# Altium project Orient2.PrjPcb (part 2 of 6)

## Sheet P02_MPU1_JTAG.SchDoc
size A
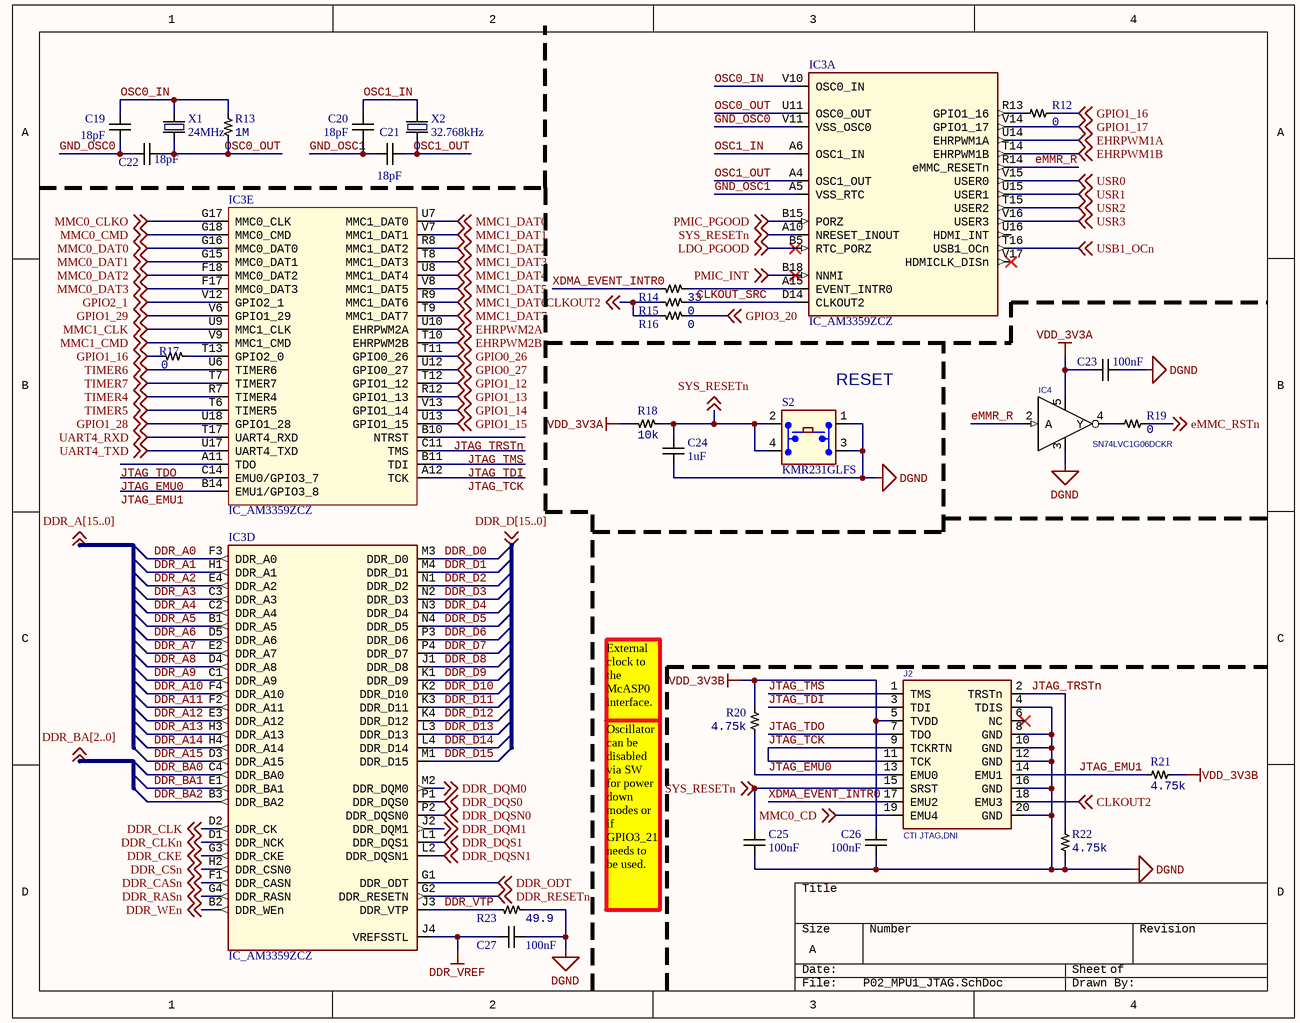
[diagram p1: P02_MPU1_JTAG.SchDoc]

### Parts
C19  Capacitance: 18pF  [CAP0402]  (hidden comment: CC0402JRNPO9BN180)
C20  Capacitance: 18pF  [CAP0402]  (hidden comment: CC0402JRNPO9BN180)
C21  Capacitance: 18pF  [CAP0402]  (hidden comment: CC0402JRNPO9BN180)
C22  Capacitance: 18pF  [CAP0402]  (hidden comment: CC0402JRNPO9BN180)
C23  Capacitance: 100nF  [CAP0402]  (hidden comment: C0402C104K4RACTU)
C24  Capacitance: 1uF  [CAP0402]  (hidden comment: CC0402KRX5R6BB105)
C25  Capacitance: 100nF  [CAP0402]  (hidden comment: C0402C104K4RACTU)
C26  Capacitance: 100nF  [CAP0402]  (hidden comment: C0402C104K4RACTU)
C27  Capacitance: 100nF  [CAP0402]  (hidden comment: C0402C104K4RACTU)
IC3  IC_AM3359ZCZ  [BGA-324]  (parts A,D,E of 7)
IC4  SN74LVC1G06DCKR  [SC70_DCK]
J2  CTI JTAG,DNI  [HEADER10X2_SMD]
R12  Resistance: 0  [RES0402]  (hidden comment: RC0402JR-070RL)
R13  Resistance: 1M  [RES0402]  (hidden comment: RC0402FR-071ML)
R14  Resistance: 33  [RES0402]  (hidden comment: RC0402FR-0733RL)
R15  Resistance: 0  [RES0402]  (hidden comment: RC0402JR-070RL)
R16  Resistance: 0  [RES0402]  (hidden comment: RC0402JR-070RL)
R17  Resistance: 0  [RES0402]  (hidden comment: RC0402JR-070RL)
R18  Resistance: 10k  [RES0402]  (hidden comment: RC0402FR-0710KL)
R19  Resistance: 0  [RES0402]  (hidden comment: RC0402JR-070RL)
R20  Resistance: 4.75k  [RES0402]  (hidden comment: RC0402FR-074K75L)
R21  Resistance: 4.75k  [RES0402]  (hidden comment: RC0402FR-074K75L)
R22  Resistance: 4.75k  [RES0402]  (hidden comment: RC0402FR-074K75L)
R23  Resistance: 49.9  [RES0402]  (hidden comment: RC0402FR-0749R9)
S2  KMR231GLFS  [SW4SMD_63X161LS]
X1  24MHz  [XTAL150SMD_125X196]
X2  32.768kHz  [SOJ-4]

### Nets
DDR_VREF: C27.1 IC3.J4(VREFSSTL)
DGND: C23.1 C24.1 C25.2 C26.2 C27.2 IC4.3(GND) J2.4(TDIS) J2.8(GND) J2.10(GND) J2.12(GND) J2.16(GND) J2.20(GND) R22.1 R23.1 S2.1(A1) S2.3(A3)
VDD_3V3A: C23.2 IC4.5(VCC) R18.1
VDD_3V3B: C26.1 J2.5(TVDD) R20.2 R21.1
CLKOUT2: J2.18(EMU3) R15.2 R16.2 ; off-sheet CLKOUT2
CLKOUT_SRC: IC3.D14(CLKOUT2) R15.1
DDR_A0: IC3.F3(DDR_A0)
DDR_A1: IC3.H1(DDR_A1)
DDR_A2: IC3.E4(DDR_A2)
DDR_A3: IC3.C3(DDR_A3)
DDR_A4: IC3.C2(DDR_A4)
DDR_A5: IC3.B1(DDR_A5)
DDR_A6: IC3.D5(DDR_A6)
DDR_A7: IC3.E2(DDR_A7)
DDR_A8: IC3.D4(DDR_A8)
DDR_A9: IC3.C1(DDR_A9)
DDR_A10: IC3.F4(DDR_A10)
DDR_A11: IC3.F2(DDR_A11)
DDR_A12: IC3.E3(DDR_A12)
DDR_A13: IC3.H3(DDR_A13)
DDR_A14: IC3.H4(DDR_A14)
DDR_A15: IC3.D3(DDR_A15)
DDR_BA0: IC3.C4(DDR_BA0)
DDR_BA1: IC3.E1(DDR_BA1)
DDR_BA2: IC3.B3(DDR_BA2)
DDR_CASn: IC3.F1(DDR_CASN) ; off-sheet DDR_CASn
DDR_CKE: IC3.G3(DDR_CKE) ; off-sheet DDR_CKE
DDR_CLK: IC3.D2(DDR_CK) ; off-sheet DDR_CLK
DDR_CLKn: IC3.D1(DDR_NCK) ; off-sheet DDR_CLKn
DDR_CSn: IC3.H2(DDR_CSN0) ; off-sheet DDR_CSn
DDR_D0: IC3.M3(DDR_D0)
DDR_D1: IC3.M4(DDR_D1)
DDR_D2: IC3.N1(DDR_D2)
DDR_D3: IC3.N2(DDR_D3)
DDR_D4: IC3.N3(DDR_D4)
DDR_D5: IC3.N4(DDR_D5)
DDR_D6: IC3.P3(DDR_D6)
DDR_D7: IC3.P4(DDR_D7)
DDR_D8: IC3.J1(DDR_D8)
DDR_D9: IC3.K1(DDR_D9)
DDR_D10: IC3.K2(DDR_D10)
DDR_D11: IC3.K3(DDR_D11)
DDR_D12: IC3.K4(DDR_D12)
DDR_D13: IC3.L3(DDR_D13)
DDR_D14: IC3.L4(DDR_D14)
DDR_D15: IC3.M1(DDR_D15)
DDR_DQM0: IC3.M2(DDR_DQM0) ; off-sheet DDR_DQM0
DDR_DQM1: IC3.J2(DDR_DQM1) ; off-sheet DDR_DQM1
DDR_DQS0: IC3.P1(DDR_DQS0) ; off-sheet DDR_DQS0
DDR_DQS1: IC3.L1(DDR_DQS1) ; off-sheet DDR_DQS1
DDR_DQSN0: IC3.P2(DDR_DQSN0) ; off-sheet DDR_DQSN0
DDR_DQSN1: IC3.L2(DDR_DQSN1) ; off-sheet DDR_DQSN1
DDR_ODT: IC3.G1(DDR_ODT) ; off-sheet DDR_ODT
DDR_RASn: IC3.G4(DDR_RASN) ; off-sheet DDR_RASn
DDR_RESETn: IC3.G2(DDR_RESETN) ; off-sheet DDR_RESETn
DDR_VTP: IC3.J3(DDR_VTP) R23.2
DDR_WEn: IC3.B2(DDR_WEn) ; off-sheet DDR_WEn
EHRPWM1A: IC3.U14(EHRPWM1A) ; off-sheet EHRPWM1A
EHRPWM1B: IC3.T14(EHRPWM1B) ; off-sheet EHRPWM1B
EHRPWM2A: IC3.U10(EHRPWM2A) ; off-sheet EHRPWM2A
EHRPWM2B: IC3.T10(EHRPWM2B) ; off-sheet EHRPWM2B
eMMC_RSTn: R19.2 ; off-sheet eMMC_RSTn
eMMR_R: IC3.R14(eMMC_RESETn) IC4.2(A)
GND_OSC0: C19.2 C22.1 IC3.V11(VSS_OSC0)
GND_OSC1: C20.1 C21.2 IC3.A5(VSS_RTC)
GPIO0_26: IC3.T11(GPIO0_26) ; off-sheet GPIO0_26
GPIO0_27: IC3.U12(GPIO0_27) ; off-sheet GPIO0_27
GPIO1_12: IC3.T12(GPIO1_12) ; off-sheet GPIO1_12
GPIO1_13: IC3.R12(GPIO1_13) ; off-sheet GPIO1_13
GPIO1_14: IC3.V13(GPIO1_14) ; off-sheet GPIO1_14
GPIO1_15: IC3.U13(GPIO1_15) ; off-sheet GPIO1_15
GPIO1_16: R12.2 R17.2 ; off-sheet GPIO1_16
GPIO1_17: IC3.V14(GPIO1_17) ; off-sheet GPIO1_17
GPIO1_28: IC3.U18(GPIO1_28) ; off-sheet GPIO1_28
GPIO1_29: IC3.V6(GPIO1_29) ; off-sheet GPIO1_29
GPIO2_1: IC3.V12(GPIO2_1) ; off-sheet GPIO2_1
GPIO3_20: R16.1 ; off-sheet GPIO3_20
JTAG_EMU0: IC3.C14(EMU0/GPIO3_7) J2.13(EMU0) R20.1
JTAG_EMU1: IC3.B14(EMU1/GPIO3_8) J2.14(EMU1) R21.2
JTAG_TCK: IC3.A12(TCK) J2.9(TCKRTN) J2.11(TCK)
JTAG_TDI: IC3.B11(TDI) J2.3(TDI)
JTAG_TDO: IC3.A11(TDO) J2.7(TDO)
JTAG_TMS: IC3.C11(TMS) J2.1(TMS)
JTAG_TRSTn: IC3.B10(NTRST) J2.2(TRSTn) R22.2
LDO_PGOOD: IC3.B5(RTC_PORZ) ; off-sheet LDO_PGOOD
MMC0_CD: J2.19(EMU4) ; off-sheet MMC0_CD
MMC0_CLKO: IC3.G17(MMC0_CLK) ; off-sheet MMC0_CLKO
MMC0_CMD: IC3.G18(MMC0_CMD) ; off-sheet MMC0_CMD
MMC0_DAT0: IC3.G16(MMC0_DAT0) ; off-sheet MMC0_DAT0
MMC0_DAT1: IC3.G15(MMC0_DAT1) ; off-sheet MMC0_DAT1
MMC0_DAT2: IC3.F18(MMC0_DAT2) ; off-sheet MMC0_DAT2
MMC0_DAT3: IC3.F17(MMC0_DAT3) ; off-sheet MMC0_DAT3
MMC1_CLK: IC3.U9(MMC1_CLK) ; off-sheet MMC1_CLK
MMC1_CMD: IC3.V9(MMC1_CMD) ; off-sheet MMC1_CMD
MMC1_DAT0: IC3.U7(MMC1_DAT0) ; off-sheet MMC1_DAT0
MMC1_DAT1: IC3.V7(MMC1_DAT1) ; off-sheet MMC1_DAT1
MMC1_DAT2: IC3.R8(MMC1_DAT2) ; off-sheet MMC1_DAT2
MMC1_DAT3: IC3.T8(MMC1_DAT3) ; off-sheet MMC1_DAT3
MMC1_DAT4: IC3.U8(MMC1_DAT4) ; off-sheet MMC1_DAT4
MMC1_DAT5: IC3.V8(MMC1_DAT5) ; off-sheet MMC1_DAT5
MMC1_DAT6: IC3.R9(MMC1_DAT6) ; off-sheet MMC1_DAT6
MMC1_DAT7: IC3.T9(MMC1_DAT7) ; off-sheet MMC1_DAT7
OSC0_IN: C19.1 IC3.V10(OSC0_IN) R13.2 X1.2
OSC0_OUT: C22.2 IC3.U11(OSC0_OUT) R13.1 X1.1
OSC1_IN: C20.2 IC3.A6(OSC1_IN) X2.1
OSC1_OUT: C21.1 IC3.A4(OSC1_OUT) X2.4
PMIC_INT: IC3.B18(NNMI) ; off-sheet PMIC_INT
PMIC_PGOOD: IC3.B15(PORZ) ; off-sheet PMIC_PGOOD
SYS_RESETn: C24.2 C25.1 IC3.A10(NRESET_INOUT) J2.15(SRST) R18.2 S2.2(A2) S2.4 ; off-sheet SYS_RESETn
TIMER4: IC3.R7(TIMER4) ; off-sheet TIMER4
TIMER5: IC3.T6(TIMER5) ; off-sheet TIMER5
TIMER6: IC3.U6(TIMER6) ; off-sheet TIMER6
TIMER7: IC3.T7(TIMER7) ; off-sheet TIMER7
UART4_RXD: IC3.T17(UART4_RXD) ; off-sheet UART4_RXD
UART4_TXD: IC3.U17(UART4_TXD) ; off-sheet UART4_TXD
USB1_OCn: IC3.T16(USB1_OCn) ; off-sheet USB1_OCn
USR0: IC3.V15(USER0) ; off-sheet USR0
USR1: IC3.U15(USER1) ; off-sheet USR1
USR2: IC3.T15(USER2) ; off-sheet USR2
USR3: IC3.V16(USER3) ; off-sheet USR3
XDMA_EVENT_INTR0: J2.17(EMU2) R14.1
NetIC3_A15: IC3.A15(EVENT_INTR0) R14.2
NetIC3_R13: IC3.R13(GPIO1_16) R12.1
NetIC3_T13: IC3.T13(GPIO2_0) R17.1
NetIC4_4: IC4.4(Y) R19.1

Not connected (* = marked no-connect by the designer): IC3 U16(HDMI_INT) V17(HDMICLK_DISn)*; J2 6(NC)*

### Notes on the sheet
- (near S2) RESET
- External clock to the
  McASP0 interface.
- Oscillator can be disabled via SW
  for power down modes or if
  GPIO3_21 needs to be used.

### Library data of the parts
C19-C22 = CAP_18pF: MLCC 18pF 0402 SMD; Manufacturer: Yageo; Tolerance: 5%; Temperature Coefficient: 30ppm/°C; Dielectric: C0G; Voltage Rating: 50V; Supplier 1: Digi-Key; Manufacturer Part Number: CC0402JRNPO9BN180; RoHS: Yes; Stock 1: 740828; Pricing 1: 1=0.10000, 10=0.02300, 100=0.01030, 500=0.00736, 1000=0.00578, 2500=0.00525, 5000=0.00483 (USD); Packaging: Tape and Reel; ComponentLink1URL: https://datasheet.ciiva.com/11788/0900766b80d84fbf-11788369.pdf?src-supplier=RSComponents; ComponentLink1Description: https://datasheet.ciiva.com/11788/0900766b80d84fbf-11788369.pdf?src-supplier=RSComponents; Mount: Surface Mount; Case/Package: 0402; Number of Pins: 2; Weight: 2.3E-05oz; Case Code (Metric): 1005; Case Code (Imperial): 0402; Min Operating Temperature: -55°C; Max Operating Temperature: 125°C; Package Quantity: 1; Voltage Rating (DC): 50V; Termination: SMD/SMT; Composition: Ceramic; Voltage: 50V; Length: 1mm; Height: 0.5mm; Width: 0.02inch; Thickness: 0.022inch; Depth: 0.5mm; Radiation Hardening: No; REACH SVHC: No SVHC; Lead Free: Lead Free; ComponentLink2URL: https://datasheet.ciiva.com/176/mlccorderingcode-176357.pdf?src-supplier=Digi-Key; ComponentLink2Description: https://datasheet.ciiva.com/176/mlccorderingcode-176357.pdf?src-supplier=Digi-Key; ComponentLink3URL: https://datasheet.ciiva.com/176/mlccorderingcode-176358.pdf?src-supplier=Digi-Key; ComponentLink3Description: https://datasheet.ciiva.com/176/mlccorderingcode-176358.pdf?src-supplier=Digi-Key; ComponentLink4URL: https://datasheet.ciiva.com/176/mlccorderingcode-176359.pdf?src-supplier=Digi-Key; ComponentLink4Description: https://datasheet.ciiva.com/176/mlccorderingcode-176359.pdf?src-supplier=Digi-Key; ComponentLink5URL: https://datasheet.ciiva.com/28450/1443161-28450232.pdf?src-supplier=Element14; ComponentLink5Description: https://datasheet.ciiva.com/28450/1443161-28450232.pdf?src-supplier=Element14; ComponentLink6URL: https://datasheet.ciiva.com/13208/upy-gp-np0-16v-to-50v-8-13208430.pdf?src-supplier=Mouser; ComponentLink6Description: https://datasheet.ciiva.com/13208/upy-gp-np0-16v-to-50v-8-13208430.pdf?src-supplier=Mouser; ComponentLink7URL: https://datasheet.ciiva.com/11587/upy-gp-np0-16v-to-50v-8-11587087.pdf?src-supplier=Avnet; ComponentLink7Description: https://datasheet.ciiva.com/11587/upy-gp-np0-16v-to-50v-8-11587087.pdf?src-supplier=Avnet
C23 C25-C27 = CAP_100nF: MLCC 100nF 0402 SMD; Manufacturer: KEMET; Tolerance: 10%; Voltage Rating (DC): 16V; Dielectric: X7R; Dissipation Factor: 3.5%; Supplier 1: Digi-Key; Manufacturer Part Number: C0402C104K4RACTU; Stock 1: 6512243; Pricing 1: 1=0.10000, 10=0.04200, 100=0.01860, 500=0.01328, 1000=0.01044, 2500=0.00949, 5000=0.00873 (USD); RoHS: Yes; Mount: Surface Mount; Case/Package: 0402; Case Code (Imperial): 0402; Case Code (Metric): 1005; Contact Plating: Tin,Matte; Min Operating Temperature: -55°C; Max Operating Temperature: 125°C; Packaging: Tape and Reel; Package Quantity: 10000; Voltage Rating: 16V; Termination: SMD/SMT; Length: 1mm; Height: 0.5mm; Width: 0.5mm; Depth: 0.5mm; Radiation Hardening: No; ComponentLink2URL: https://datasheet.ciiva.com/18192/getdatasheetpartid-385384-18192412.pdf?src-supplier=Verical; ComponentLink2Description: Datasheet; Supplier Part Number 1: 399-3521-1-ND
C24 = CAP_1uF: MLCC 1uF 0402 SMD; Manufacturer: Yageo; Tolerance: 10%; Dielectric: X5R; Voltage Rating: 10V; Dissipation Factor: 15%; ComponentLink1Description: https://datasheet.ciiva.com/176/upy-gphc-x5r-4v-to-50v-12-176704.pdf?src-supplier=Digi-Key; ComponentLink1URL: https://datasheet.ciiva.com/176/upy-gphc-x5r-4v-to-50v-12-176704.pdf?src-supplier=Digi-Key; Manufacturer Part Number: CC0402KRX5R6BB105; Packaging: Tape and Reel; Pricing 1: 1=0.10000, 10=0.06300, 100=0.02790, 500=0.01996, 1000=0.01568, 2500=0.01425, 5000=0.01311 (USD); RoHS: Yes; Stock 1: 6411796; Supplier 1: Digi-Key; Mount: Surface Mount; Case/Package: 0402; Number of Pins: 2; Case Code (Metric): 1005; Case Code (Imperial): 0402; Min Operating Temperature: -55°C; Max Operating Temperature: 85°C; Package Quantity: 1; Voltage Rating (DC): 10V; Termination: SMD/SMT; Composition: Ceramic; Length: 1mm; Height: 0.5mm; Width: 0.02inch; Thickness: 0.022inch; Depth: 0.5mm; Radiation Hardening: No; REACH SVHC: No SVHC; Lead Free: Lead Free; Halogen Free: Halogen Free; ComponentLink2URL: https://datasheet.ciiva.com/176/mlccorderingcode-176706.pdf?src-supplier=Digi-Key; ComponentLink2Description: https://datasheet.ciiva.com/176/mlccorderingcode-176706.pdf?src-supplier=Digi-Key; ComponentLink3URL: https://datasheet.ciiva.com/176/mlccorderingcode-176705.pdf?src-supplier=Digi-Key; ComponentLink3Description: https://datasheet.ciiva.com/176/mlccorderingcode-176705.pdf?src-supplier=Digi-Key
IC3 = IC_AM335X_ZCE_1: SubArctic Cortex A8 Processor 18x18; Manufacturer: Texas Instruments; Manufacturer Part Number: XAM3359ZCZ; Processor Type: ARM Microprocessor; Voltage: 1.06 V ~ 1.15 V; Supplier 1: Digi-Key; Supplier Part Number 1: 296-35073-ND; RoHS: RoHS Compliant; Category: Integrated Circuits (ICs); Stock 1: 16; Pricing 1: 1=33.5, 10=30.988, 100=26.465, 250=24.28752, 500=23.115, 1000=21.775, 2500=21.105, 5000=20.6025, 10000=20.1 (USD); Features: -; Speed: -; Mounting Type: Surface Mount; Package / Case: 324-LFBGA; Supplier Device Package: 324-NFBGA(15x15); Packaging: Tray; ComponentLink1URL: http://www.ti.com/lit/ds/symlink/am3354.pdf; ComponentLink1Description: http://www.ti.com/lit/ds/symlink/am3354.pdf
IC4 = IC_Inverter: IC INVERTER SINGLE 1INPUT SC705; Manufacturer: Texas Instruments; Manufacturer Part Number: SN74LVC1G06DCKTG4; Logic Type: Inverter, Buffer; Number of Circuits: 1; Voltage - Supply: 1.65 V ~ 5.5 V; Current - Quiescent (Max): 10µA; Current - Output High, Low: -, 32mA; Logic Level - Low: 0.7 V ~ 0.8 V; Logic Level - High: 1.7 V ~ 2 V; Max Propagation Delay @ V, Max CL: 3ns @ 5V, 50pF; Logic Function: Buffer,Inverter; Polarity: Inverting; Max Supply Voltage: 5.5V; Min Supply Voltage: 1.65V; Propagation Delay: 6.5ns; Quiescent Current: 10uA; Low Level Output Current: 32mA; Turn-On Delay Time: 3ns; Supplier 1: Digi-Key; Supplier Part Number 1: SN74LVC1G06DCKTG4-ND; RoHS: RoHS Compliant; Category: Integrated Circuits (ICs); Stock 1: 0; Pricing 1: 1250=0.32 (USD); Number of Inputs: 1; Features: Open Drain; Operating Temperature: -40°C ~ 85°C; Mounting Type: Surface Mount; Supplier Device Package: SC-70-5; Package / Case: 6-TSSOP (5 Lead), SC-88A, SOT-353; Packaging: Tape & Reel (TR); ComponentLink1URL: http://www.ti.com/lit/ds/symlink/sn74lvc1g06.pdf; ComponentLink1Description: http://www.ti.com/lit/ds/symlink/sn74lvc1g06.pdf; Supplier 2: Digi-Key; Stock 2: 23745; Pricing 2: 1=0.33000, 10=0.24700, 100=0.14000, 500=0.09270, 1000=0.07107 (USD); Mount: Surface Mount; Case/Package: SC; Number of Pins: 5; Contact Plating: Gold; Min Operating Temperature: -40°C; Max Operating Temperature: 125°C; Package Quantity: 3000; Number of Elements: 1; Number of Gates: 1; Number of Bits: 1; Number of Channels: 1; Number of Outputs: 1; Number of Input Lines: 1; Number of Output Lines: 1; Output Current: 32mA; High Level Output Current: 32mA; Length: 2mm; Height: 0.9mm; Width: 1.25mm; Radiation Hardening: No; Lead Free: Lead Free; REACH SVHC: No SVHC; ComponentLink2URL: https://datasheet.ciiva.com/15094/getdatasheetpartid-76668-15094547.pdf?src-supplier=Verical; ComponentLink2Description: https://datasheet.ciiva.com/15094/getdatasheetpartid-76668-15094547.pdf?src-supplier=Verical; ComponentLink3URL: https://datasheet.ciiva.com/34301/1043820-34301914.pdf?src-supplier=Jameco; ComponentLink3Description: https://datasheet.ciiva.com/34301/1043820-34301914.pdf?src-supplier=Jameco; ComponentLink4URL: https://datasheet.ciiva.com/1864/sn74lvc1g06-1864401.pdf?src-supplier=Digi-Key; ComponentLink4Description: https://datasheet.ciiva.com/1864/sn74lvc1g06-1864401.pdf?src-supplier=Digi-Key; ComponentLink5URL: https://datasheet.ciiva.com/1864/sn74lvc1g06-1864402.pdf?src-supplier=Digi-Key; ComponentLink5Description: https://datasheet.ciiva.com/1864/sn74lvc1g06-1864402.pdf?src-supplier=Digi-Key; ComponentLink6URL: https://datasheet.ciiva.com/1864/sn74lvc1g06-1864403.pdf?src-supplier=Digi-Key; ComponentLink6Description: https://datasheet.ciiva.com/1864/sn74lvc1g06-1864403.pdf?src-supplier=Digi-Key; ComponentLink7URL: https://datasheet.ciiva.com/16531/sn74lvc1g06-16531989.pdf?src-supplier=Avnet+Asia; ComponentLink7Description: https://datasheet.ciiva.com/16531/sn74lvc1g06-16531989.pdf?src-supplier=Avnet+Asia; ComponentLink8URL: https://datasheet.ciiva.com/7783/1633749-7783590.pdf?src-supplier=Element14; ComponentLink8Description: https://datasheet.ciiva.com/7783/1633749-7783590.pdf?src-supplier=Element14; ComponentLink9URL: https://datasheet.ciiva.com/46442/1857056-46442057.pdf?src-supplier=Element14; ComponentLink9Description: https://datasheet.ciiva.com/46442/1857056-46442057.pdf?src-supplier=Element14; ComponentLink10URL: https://datasheet.ciiva.com/26220/sn74lvc1g06-26220911.pdf?src-supplier=Avnet+Europe; ComponentLink10Description: https://datasheet.ciiva.com/26220/sn74lvc1g06-26220911.pdf?src-supplier=Avnet+Europe
J2 = HDR_10x2_CJTAG: Dual Line Header 10x2pin Tin; Manufacturer: Samtec Inc; Manufacturer Part Number: FTR-110-03-G-D-06; Connector Type: Unshrouded; Number of Positions: 20; Number of Positions Loaded: 19; Pitch: 0.050" (1.27mm); Row Spacing: 0.100" (2.54mm); Supplier 1: Digi-Key; Supplier Part Number 1: FTR-110-03-G-D-06-ND; RoHS: RoHS Compliant; Category: Connectors, Interconnects; Stock 1: 0; Pricing 1: 1=4.47 (USD); Number of Rows: 2; Height Stacking (Mating): -; Molding Height Above Board: 0.100" (2.54mm); Contact Mating Length: 0.125" (3.18mm); Mounting Type: Surface Mount; Termination: Solder; Contact Finish: Gold; Contact Finish Thickness: 10µin (0.25µm); Features: -; Color: Black; Packaging: Tube; ComponentLink1URL: http://www.samtec.com/documents/webfiles/cpdf/FTR-1XX-XX-XX-D-X-XX-MKT.pdf; ComponentLink1Description: http://www.samtec.com/documents/webfiles/cpdf/FTR-1XX-XX-XX-D-X-XX-MKT.pdf
R12 R15-R17 R19 = RES_0: Resistor 0Ohm 0402 SMD; Manufacturer: Yageo; Power Rating: 62.5mW; Tolerance: 5%; Voltage Rating: 50V; Temperature Coefficient: 200ppm/°C; Max Power Dissipation: 63mW; Supplier 1: Digi-Key; Manufacturer Part Number: RC0402JR-070RL; Stock 1: 68160806; Pricing 1: 1=0.10000, 10=0.01300, 25=0.00920, 50=0.00700, 100=0.00510, 250=0.00392, 500=0.00312, 1000=0.00230, 5000=0.00165 (USD); RoHS: Yes; Case/Package: 0402; Contact Plating: Tin,Matte; Case Code (Metric): 1005; Case Code (Imperial): 0402; Min Operating Temperature: -55°C; Max Operating Temperature: 155°C; Composition: Thick Film; Packaging: Tape and Reel; Termination: SMD/SMT; Package Quantity: 1; Number of Terminations: 2; Military Standard: Not; Features: Moisture Resistant; Length: 1mm; Height: 0.016inch; Width: 0.02inch; Depth: 0.5mm; Radiation Hardening: No; Lead Free: Lead Free; REACH SVHC: Unknown; Supplier Part Number 1: 311-0.0JRCT-ND; ComponentLink1Description: Digikey; ComponentLink1URL: https://www.digikey.com/product-detail/en/yageo/RC0402JR-070RL/311-0.0JRCT-ND/729353; ComponentLink2Description: Datasheet; ComponentLink2URL: https://www.yageo.com/upload/media/product/productsearch/datasheet/rchip/PYu-RC_Group_51_RoHS_L_10.pdf
R13 = RES_1M: Resistor 1MOhm 0402 SMD; Manufacturer: Yageo; Temperature Coefficient: 100ppm/°C; Tolerance: 1%; Power Rating: 63mW; Voltage Rating: 50V; Supplier 1: Digi-Key; Manufacturer Part Number: RC0402FR-071ML; RoHS: Yes; Stock 1: 11890826; Pricing 1: 1=0.10000, 10=0.01500, 100=0.00600, 1000=0.00268, 2500=0.00232, 5000=0.00192 (USD); Composition: Thick Film; Height: 0.32mm; Packaging: Tape and Reel; ComponentLink1URL: https://datasheet.ciiva.com/11808/0900766b80c66297-11808125.pdf?src-supplier=RSComponents; ComponentLink1Description: https://datasheet.ciiva.com/11808/0900766b80c66297-11808125.pdf?src-supplier=RSComponents; Case/Package: 0402; Case Code (Imperial): 0402; Case Code (Metric): 1005; Min Operating Temperature: -55°C; Max Operating Temperature: 155°C; Termination: SMD/SMT; Military Standard: Not; Length: 1mm; Depth: 0.5mm; REACH SVHC: Unknown; Lead Free: Lead Free; ComponentLink2URL: https://datasheet.ciiva.com/46394/1018594-46394951.pdf?src-supplier=Element14; ComponentLink2Description: https://datasheet.ciiva.com/46394/1018594-46394951.pdf?src-supplier=Element14; ComponentLink3URL: https://datasheet.ciiva.com/16741/pyu-rc0402-51-rohs-l-6-r-16741081.pdf?src-supplier=Future+Electronics; ComponentLink3Description: https://datasheet.ciiva.com/16741/pyu-rc0402-51-rohs-l-6-r-16741081.pdf?src-supplier=Future+Electronics; ComponentLink4URL: https://datasheet.ciiva.com/7849/1018594-7849882.pdf?src-supplier=Element14; ComponentLink4Description: https://datasheet.ciiva.com/7849/1018594-7849882.pdf?src-supplier=Element14; ComponentLink5URL: https://datasheet.ciiva.com/7849/1018594-7849883.pdf?src-supplier=Element14; ComponentLink5Description: https://datasheet.ciiva.com/7849/1018594-7849883.pdf?src-supplier=Element14
R14 = RES_33: Resistor 33Ohm 0402 SMD; Manufacturer: Yageo; Temperature Coefficient: 100ppm/°C; Tolerance: 1%; Power Rating: 62.5mW; Voltage Rating: 50V; Supplier 1: Digi-Key; Manufacturer Part Number: RC0402FR-0733RL; RoHS: Yes; Stock 1: 5631148; Pricing 1: 1=0.10000, 10=0.01600, 100=0.00640, 1000=0.00289, 2500=0.00251, 5000=0.00207 (USD); Composition: Thick Film; Height: 0.35mm; Packaging: Tape and Reel; ComponentLink1URL: https://datasheet.ciiva.com/11819/0900766b80c66297-11819487.pdf?src-supplier=RSComponents; ComponentLink1Description: https://datasheet.ciiva.com/11819/0900766b80c66297-11819487.pdf?src-supplier=RSComponents; Case/Package: 0402; Number of Pins: 2; Case Code (Imperial): 0402; Case Code (Metric): 1005; Min Operating Temperature: -55°C; Max Operating Temperature: 155°C; Voltage Rating (DC): 50V; Package Quantity: 10000; Termination: SMD/SMT; Military Standard: Not; Length: 1mm; Width: 0.5mm; Depth: 0.5mm; REACH SVHC: Unknown; Lead Free: Lead Free; ComponentLink2URL: https://datasheet.ciiva.com/15189/getdatasheetpartid-329253-15189431.pdf?src-supplier=Verical; ComponentLink2Description: https://datasheet.ciiva.com/15189/getdatasheetpartid-329253-15189431.pdf?src-supplier=Verical; ComponentLink3URL: https://datasheet.ciiva.com/24070/pyu-rc0402-51-rohs-l-6-r-8721-24070077.pdf?src-supplier=Mouser; ComponentLink3Description: https://datasheet.ciiva.com/24070/pyu-rc0402-51-rohs-l-6-r-8721-24070077.pdf?src-supplier=Mouser; ComponentLink4URL: https://datasheet.ciiva.com/7849/1018594-7849966.pdf?src-supplier=Element14; ComponentLink4Description: https://datasheet.ciiva.com/7849/1018594-7849966.pdf?src-supplier=Element14; ComponentLink5URL: https://datasheet.ciiva.com/7849/1018594-7849967.pdf?src-supplier=Element14; ComponentLink5Description: https://datasheet.ciiva.com/7849/1018594-7849967.pdf?src-supplier=Element14; ComponentLink6URL: https://datasheet.ciiva.com/17070/pyu-rc0402-51-rohs-l-6-r-17070335.pdf?src-supplier=Future+Electronics; ComponentLink6Description: https://datasheet.ciiva.com/17070/pyu-rc0402-51-rohs-l-6-r-17070335.pdf?src-supplier=Future+Electronics
R18 = RES_10k: Resistor 10kOhm 0402 SMD; Manufacturer: Yageo; Temperature Coefficient: 100ppm/°C; Tolerance: 1%; Voltage Rating (DC): 50V; Power Rating: 62.5mW; Supplier 1: Digi-Key; Manufacturer Part Number: RC0402FR-0710KL; RoHS: Yes; Stock 1: 72891652; Pricing 1: 1=0.10000, 10=0.01500, 100=0.00600, 1000=0.00270, 2500=0.00235, 5000=0.00194 (USD); Composition: Thick Film; Height: 0.32mm; Number of Terminations: 2; Packaging: Tape and Reel; ComponentLink1URL: https://datasheet.ciiva.com/7660/38568-7660787.pdf?src-supplier=Element14; ComponentLink1Description: https://datasheet.ciiva.com/7660/38568-7660787.pdf?src-supplier=Element14; Case/Package: 0402; Number of Pins: 2; Case Code (Imperial): 0402; Case Code (Metric): 1005; Min Operating Temperature: -55°C; Max Operating Temperature: 155°C; Voltage Rating: 50V; Termination: SMD/SMT; Military Standard: Not; Working Voltage: 50V; Length: 1mm; Width: 0.5mm; Depth: 0.5mm; Lead Pitch: 0.2mm; REACH SVHC: No SVHC; Lead Free: Lead Free; ComponentLink2URL: https://datasheet.ciiva.com/7983/1018594-7983486.pdf?src-supplier=Element14; ComponentLink2Description: https://datasheet.ciiva.com/7983/1018594-7983486.pdf?src-supplier=Element14; ComponentLink3URL: https://datasheet.ciiva.com/7849/1784430-7849813.pdf?src-supplier=Element14; ComponentLink3Description: https://datasheet.ciiva.com/7849/1784430-7849813.pdf?src-supplier=Element14; ComponentLink4URL: https://datasheet.ciiva.com/7849/1686128-7849814.pdf?src-supplier=Element14; ComponentLink4Description: https://datasheet.ciiva.com/7849/1686128-7849814.pdf?src-supplier=Element14; ComponentLink5URL: https://datasheet.ciiva.com/7849/1784430-7849815.pdf?src-supplier=Element14; ComponentLink5Description: https://datasheet.ciiva.com/7849/1784430-7849815.pdf?src-supplier=Element14; ComponentLink6URL: https://datasheet.ciiva.com/22747/1018594-22747512.pdf?src-supplier=Element14; ComponentLink6Description: https://datasheet.ciiva.com/22747/1018594-22747512.pdf?src-supplier=Element14; ComponentLink7URL: https://datasheet.ciiva.com/12667/pyu-rc0402-51-rohs-l-6-r-12667067.pdf?src-supplier=Mouser; ComponentLink7Description: https://datasheet.ciiva.com/12667/pyu-rc0402-51-rohs-l-6-r-12667067.pdf?src-supplier=Mouser
R20-R22 = RES_4.75k: Resistor 4.75kOhm 0402 SMD; Manufacturer: Yageo; Temperature Coefficient: 100ppm/°C; Tolerance: 1%; Voltage Rating: 50V; Power Rating: 62.5mW; Max Power Dissipation: 63mW; Supplier 1: Digi-Key; Manufacturer Part Number: RC0402FR-074K75L; RoHS: Yes; Stock 1: 9368381; Pricing 1: 1=0.10000, 10=0.01600, 100=0.00640, 1000=0.00289, 2500=0.00251, 5000=0.00207 (USD); Composition: Thick Film; Features: Moisture Resistant; Height: 0.016inch; Number of Terminations: 2; Packaging: Tape and Reel; ComponentLink1URL: https://datasheet.ciiva.com/11808/0900766b80c66297-11808814.pdf?src-supplier=RSComponents; ComponentLink1Description: https://datasheet.ciiva.com/11808/0900766b80c66297-11808814.pdf?src-supplier=RSComponents; Case/Package: 0402; Case Code (Imperial): 0402; Case Code (Metric): 1005; Min Operating Temperature: -55°C; Max Operating Temperature: 155°C; Package Quantity: 1; Termination: SMD/SMT; Military Standard: Not; Voltage Rating (DC): 50V; Working Voltage: 50V; Length: 1mm; Width: 0.5mm; Depth: 0.5mm; REACH SVHC: No SVHC; Lead Free: Lead Free; ComponentLink2URL: https://datasheet.ciiva.com/15189/getdatasheetpartid-326465-15189478.pdf?src-supplier=Verical; ComponentLink2Description: https://datasheet.ciiva.com/15189/getdatasheetpartid-326465-15189478.pdf?src-supplier=Verical; ComponentLink3URL: https://datasheet.ciiva.com/2553/pyu-r-int-thick-7-2553224.pdf?src-supplier=Digi-Key; ComponentLink3Description: https://datasheet.ciiva.com/2553/pyu-r-int-thick-7-2553224.pdf?src-supplier=Digi-Key; ComponentLink4URL: https://datasheet.ciiva.com/7983/1018594-7983544.pdf?src-supplier=Element14; ComponentLink4Description: https://datasheet.ciiva.com/7983/1018594-7983544.pdf?src-supplier=Element14; ComponentLink5URL: https://datasheet.ciiva.com/2553/pyu-r-int-thick-7-2553225.pdf?src-supplier=Digi-Key; ComponentLink5Description: https://datasheet.ciiva.com/2553/pyu-r-int-thick-7-2553225.pdf?src-supplier=Digi-Key; ComponentLink6URL: https://datasheet.ciiva.com/2553/pyu-r-int-thick-7-2553226.pdf?src-supplier=Digi-Key; ComponentLink6Description: https://datasheet.ciiva.com/2553/pyu-r-int-thick-7-2553226.pdf?src-supplier=Digi-Key; ComponentLink7URL: https://datasheet.ciiva.com/16744/pyu-rc0402-51-rohs-l-6-r-16744524.pdf?src-supplier=Future+Electronics; ComponentLink7Description: https://datasheet.ciiva.com/16744/pyu-rc0402-51-rohs-l-6-r-16744524.pdf?src-supplier=Future+Electronics
R23 = RES_49.9: Resistor 49.9Ohm 0402 SMD; Manufacturer: Yageo; Manufacturer Part Number: RC0402FR-0749R9L; Temperature Coefficient: 100ppm/°C; Tolerance: 1%; Max Power Dissipation: 63mW; Power Rating: 62.5mW; Voltage Rating: 50V; Supplier 1: Digi-Key; RoHS: Yes; Stock 1: 17398038; Pricing 1: 1=0.10000, 10=0.01600, 100=0.00640, 1000=0.00289, 2500=0.00251, 5000=0.00207 (USD); Composition: Thick Film; Features: Moisture Resistant; Height: 0.016inch; Number of Terminations: 2; Packaging: Tape and Reel; ComponentLink1URL: https://datasheet.ciiva.com/11819/0900766b80c66297-11819508.pdf?src-supplier=RSComponents; ComponentLink1Description: https://datasheet.ciiva.com/11819/0900766b80c66297-11819508.pdf?src-supplier=RSComponents; Case/Package: 0402; Number of Pins: 2; Case Code (Imperial): 0402; Case Code (Metric): 1005; Min Operating Temperature: -55°C; Max Operating Temperature: 155°C; Package Quantity: 1; Termination: SMD/SMT; Military Standard: Not; Voltage Rating (DC): 50V; Working Voltage: 50V; Length: 1mm; Width: 0.5mm; Depth: 0.5mm; REACH SVHC: No SVHC; Lead Free: Lead Free; ComponentLink2URL: https://datasheet.ciiva.com/7983/1018594-7983542.pdf?src-supplier=Element14; ComponentLink2Description: https://datasheet.ciiva.com/7983/1018594-7983542.pdf?src-supplier=Element14; ComponentLink3URL: https://datasheet.ciiva.com/16743/pyu-rc0402-51-rohs-l-6-r-16743942.pdf?src-supplier=Future+Electronics; ComponentLink3Description: https://datasheet.ciiva.com/16743/pyu-rc0402-51-rohs-l-6-r-16743942.pdf?src-supplier=Future+Electronics; ComponentLink4URL: https://datasheet.ciiva.com/22747/1018594-22747514.pdf?src-supplier=Element14; ComponentLink4Description: https://datasheet.ciiva.com/22747/1018594-22747514.pdf?src-supplier=Element14; ComponentLink5URL: https://datasheet.ciiva.com/2453/pyu-r-int-thick-7-2453355.pdf?src-supplier=Digi-Key; ComponentLink5Description: https://datasheet.ciiva.com/2453/pyu-r-int-thick-7-2453355.pdf?src-supplier=Digi-Key; ComponentLink6URL: https://datasheet.ciiva.com/2453/pyu-r-int-thick-7-2453356.pdf?src-supplier=Digi-Key; ComponentLink6Description: https://datasheet.ciiva.com/2453/pyu-r-int-thick-7-2453356.pdf?src-supplier=Digi-Key; ComponentLink7URL: https://datasheet.ciiva.com/2453/pyu-r-int-thick-7-2453357.pdf?src-supplier=Digi-Key; ComponentLink7Description: https://datasheet.ciiva.com/2453/pyu-r-int-thick-7-2453357.pdf?src-supplier=Digi-Key
S2 = KMR2: Microminiature Tact Switch for SMT; Manufacturer: C&K Components; Circuit: SPST-NO; Switch Function: Off-Mom; Contact Rating @ Voltage: 0.05A @ 32VDC; Actuator Type: Standard; Actuator Height off PCB, from Pins: 1.90mm; Actuator Orientation: Top Actuated; Outline: 4.60mm x 2.80mm; Illumination: Non-Illuminated; Operating Force: 300gf; Switch Travel: 0.25mm; Mechanical Life: 150,000 Cycles; Supplier 1: Digi-Key; Supplier Part Number 1: 401-1429-6-ND; Manufacturer Part Number: KMR231GLFS; RoHS: RoHS Compliant; Category: Switches; Stock 1: 32289; Pricing 1: 1=0.44, 10=0.416, 25=0.3744, 50=0.3326, 100=0.3188, 250=0.29108, 500=0.2772, 1000=0.22869 (USD); Mounting Type: Surface Mount; Termination Style: Gull Wing; Illumination Voltage (Nominal): -; Illumination Type, Color: -; Ingress Protection: -; Features: Grounding Pin; Packaging: Digi-Reel®; Actuator Material: -; Operating Temperature: -40°C ~ 85°C; ComponentLink1URL: http://www.ck-components.com/index.php?module=media&action=Display&cmpref=14414&lang=en&width=&height=&format=&alt=; ComponentLink1Description: http://www.ck-components.com/index.php?module=media&action=Display&cmpref=14414&lang=en&width=&height=&format=&alt=
X1 = CRYS_24MHz_SCC: CRYSTAL 24.000MHZ 18PF SMD; Manufacturer: TXC CORPORATION; Manufacturer Part Number: 7A-24.000MAAJ-T; Frequency Stability: ±30ppm; ESR (Equivalent Series Resistance): 50 Ohm; Operating Mode: Fundamental; Supplier 1: Digi-Key; Supplier Part Number 1: 887-1090-6-ND; RoHS: RoHS Compliant; Category: Crystals and Oscillators; Stock 1: 2524; Pricing 1: 1=0.79, 10=0.658, 50=0.59, 100=0.525, 500=0.5 (USD); Type: MHz Crystal; Frequency: 24MHz; Frequency Tolerance: ±30ppm; Load Capacitance: 18pF; Operating Temperature: -20°C ~ 70°C; Ratings: -; Mounting Type: Surface Mount; Package / Case: 2-SMD; Size / Dimension: 0.197" L x 0.126" W (5.00mm x 3.20mm); Height: 0.053" (1.35mm); Packaging: Digi-Reel®; ComponentLink1URL: http://www.txccrystal.com/images/pdf/7a.pdf; ComponentLink1Description: http://www.txccrystal.com/images/pdf/7a.pdf
X2 = CRYS_32.768kHz: CRYSTAL 32.768KHZ 12.5PF SMD; Manufacturer: Citizen Finetech Miyota; Manufacturer Part Number: CM200C-32.768KAZF-UT; Frequency Tolerance: ±30ppm; ESR (Equivalent Series Resistance): 50 kOhm; Operating Mode: Fundamental; Supplier 1: Digi-Key; Supplier Part Number 1: 300-8738-6-ND; RoHS: RoHS Compliant; Category: Crystals and Oscillators; Stock 1: 0; Pricing 1: 1=0.75, 10=0.65, 50=0.57, 100=0.45, 500=0.38, 1000=0.3 (USD); Type: kHz Crystal (Tuning Fork); Frequency: 32.768kHz; Frequency Stability: -; Load Capacitance: 12.5pF; Operating Temperature: -40°C ~ 85°C; Ratings: -; Mounting Type: Surface Mount; Package / Case: 4-SOJ, 5.50mm pitch; Size / Dimension: 0.311" L x 0.146" W (7.90mm x 3.70mm); Height: 0.098" (2.50mm); Packaging: Digi-Reel®; ComponentLink1URL: http://cfm.citizen.co.jp/english/product/pdf/CM200C_250C.pdf; ComponentLink1Description: http://cfm.citizen.co.jp/english/product/pdf/CM200C_250C.pdf